# Altium project Camera_Board.PrjPcb
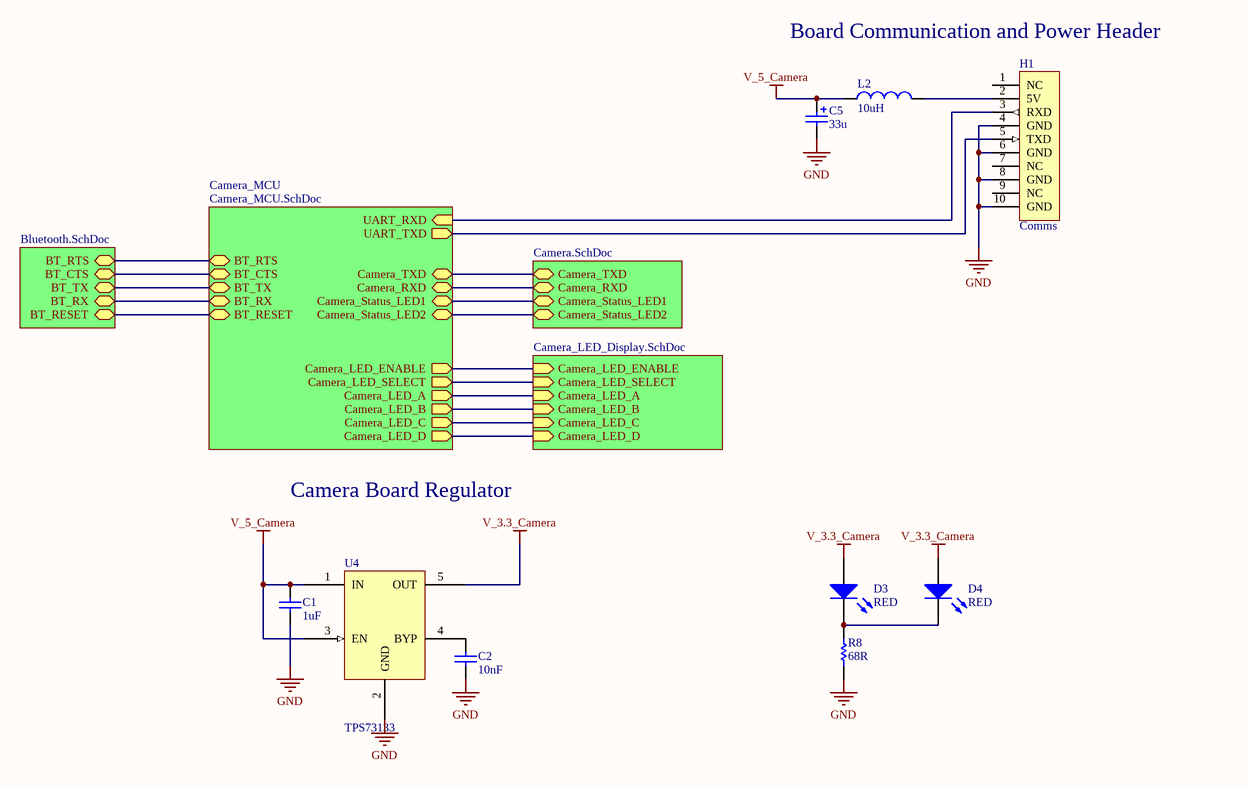
[diagram p0: Camera_Board.SchDoc]
5 sheets, 71 parts. Net scope: hierarchical (ports join the sheet entries above them; power ports are global).
Board file: Camera_Board.PcbDoc
Sheets:
  Camera_Board.SchDoc
     = Bluetooth.SchDoc
     = Camera.SchDoc
    Camera_MCU = Camera_MCU.SchDoc
     = Camera_LED_Display.SchDoc

## Sheet Camera_Board.SchDoc: Camera Board
size A4; DrawnBy: byu17; Organization: ENEL429 Group 9; Address1: ECE Department; Address2: University of Canterbury; Address3: Christchurch 8041; Address4: New Zealand; Revision: 1; SheetNumber: 1; SheetTotal: 4

### Parts
C1  1uF  [0603]
C2  10nF  [0603]
C5  value 33u  [6032]  (hidden comment: CP_TANT_33uF)
D3  value RED  [Diode_0805]  (hidden comment: LED Red)
D4  value RED  [Diode_0805]  (hidden comment: LED Red)
H1  Comms  [918510x323]
L2  10uH  [WE-PD]
R8  68R  [0603]
U4  TPS73133  [DBV005]

### Sub-sheets
Camera_MCU = Camera_MCU.SchDoc: BT_RTS, BT_CTS, BT_RESET, Camera_TXD, Camera_RXD, BT_TX, BT_RX, Camera_Status_LED1, Camera_Status_LED2, UART_TXD (out), UART_RXD (in), Camera_LED_B (out), Camera_LED_C (out), Camera_LED_ENABLE (out), Camera_LED_SELECT (out), Camera_LED_A (out), Camera_LED_D (out)
? = Bluetooth.SchDoc: BT_RX, BT_TX, BT_RTS, BT_CTS, BT_RESET
? = Camera.SchDoc: Camera_RXD, Camera_Status_LED1, Camera_Status_LED2, Camera_TXD
? = Camera_LED_Display.SchDoc: Camera_LED_ENABLE (in), Camera_LED_A (in), Camera_LED_B (in), Camera_LED_C (in), Camera_LED_D (in), Camera_LED_SELECT (in)

### Nets
GND: C1.1 C2.1 C5.2 H1.4(GND) H1.6(GND) H1.8(GND) H1.10(GND) R8.1 U4.2(GND)
V_3.3_Camera: D3.1(A) D4.1(A) U4.5(OUT)
V_5_Camera: C1.2 C5.1 L2.1 U4.1(IN) U4.3(EN)
PA0: sheet Camera_MCU/Camera_LED_A, sheet /Camera_LED_A
PA1: sheet Camera_MCU/Camera_LED_B, sheet /Camera_LED_B
PA2: sheet Camera_MCU/Camera_LED_C, sheet /Camera_LED_C
PA3: sheet Camera_MCU/Camera_LED_D, sheet /Camera_LED_D
PA6: sheet Camera_MCU/Camera_LED_ENABLE, sheet /Camera_LED_ENABLE
PA7: sheet Camera_MCU/Camera_LED_SELECT, sheet /Camera_LED_SELECT
PC2: sheet /BT_TX, sheet Camera_MCU/BT_TX
PC3: sheet /BT_RX, sheet Camera_MCU/BT_RX
PD0: sheet /BT_RTS, sheet Camera_MCU/BT_RTS
PD1: sheet /BT_CTS, sheet Camera_MCU/BT_CTS
PD2: sheet /BT_RESET, sheet Camera_MCU/BT_RESET
PD3: sheet /Camera_Status_LED1, sheet Camera_MCU/Camera_Status_LED1
PD4: sheet /Camera_Status_LED2, sheet Camera_MCU/Camera_Status_LED2
PD6: sheet /Camera_TXD, sheet Camera_MCU/Camera_TXD
PD7: sheet /Camera_RXD, sheet Camera_MCU/Camera_RXD
PE2: H1.3(RXD) ; sheet Camera_MCU/UART_RXD
PE3: H1.5(TXD) ; sheet Camera_MCU/UART_TXD
NetC2_2: C2.2 U4.4(BYP)
NetD3_2: D3.2(K) D4.2(K) R8.2
NetH1_2: H1.2(5V) L2.2

Not connected (* = marked no-connect by the designer): H1 1(NC) 7(NC) 9(NC)

### Notes on the sheet
- Board Communication and Power Header
- Camera Board Regulator
- Title
- Drawn by:
- Date:
- Time:
- Revision:
- Sheet
- of
- File:

### Library data of the parts
C1 = CP_1uF_50V_0603: CAP CER 1.0UF 50V X7R 0603; Manufacturer: Taiyo Yuden; Manufacturer PN: UMK107C5105KA-T; Supplier Part Number 1: 445-5090-2-ND; Supplier 1: Digi-Key; Value: 1uF; Part Number: CP_1uF_50V_0603; Component Kind: Standard; Component Type: Standard; Designator: CP_1uF_50V_0603; Pin Count: 2; Signal Integrity: Cap; Simulation: CAP
C2 = CP_10nF 0603: CAP CER 10000PF 100V X7R 0603; Manufacturer: Taiyo Yuden; Manufacturer PN: HMK107B7103KA-T; Supplier 1: Digi-Key; Supplier Part Number 1: 587-1446-2-ND; Value: 10nF; Part Number: CP_10nF 0603; Component Kind: Standard; Component Type: Standard; Designator: CP_10nF 0603; Pin Count: 2; Signal Integrity: Cap; Simulation: CAP
C5 = CP_TANT_33UF_20V: CAP TANT 33UF 20V 10% SMD; Manufacturer: Vishay; Manufacturer PN: TR3C336K020C0200; Signal Integrity: Cap Pol; Latest Revision Date: 20 Feb 09; Supplier 1: Digi-Key; Supplier Part Number 1: 718-1507-2-ND; Part Number: CP_TANT_33UF_20V; Component Kind: Standard; Component Type: Standard; Designator: CP_TANT_33UF_20V; Pin Count: 2; Simulation: CAP
D3 D4 = DL_LED Red 0805: Red LED 0805; Manufacturer PN: TLMS2100-GS08; Manufacturer: Vishay; Supplier 1: Digi-Key; Supplier Part Number 1: 350-2038-1-ND; Part Number: DL_LED Red 0805; Component Kind: Standard; Component Type: Standard; Designator: DL_LED Red 0805; Pin Count: 2; Simulation: LED0
H1 = Header 10: Header, IDC 10-Pin; LatestRevisionDate: 17-Jul-2002; LatestRevisionNote: Re-released for DXP Platform.; Publisher: Altium Limited
L2 = IN_10uH 2A SMT: INDUCTOR POWER 10UH 2.0A SMD; Manufacturer: Wurth Electronics Inc; Manufacturer PN: 744777910; LatestRevisionDate: 29 May 08; Supplier 1: Digi-Key; Supplier Part Number 1: 732-1191-1-ND; Value: 10uH; Part Number: IN_10uH 2A SMT; Component Kind: Standard; Component Type: Standard; Designator: IN_10uH 2A SMT; Pin Count: 2; Signal Integrity: Inductor; Simulation: INDUCTOR
R8 = RS_68R 0603: RES 68 OHM 1/10W 1% 0603 SMD; Manufacturer: Yageo; Manufacturer PN: RC0603FR-0768KL; LatestRevisionDate: 6 May 2011; Supplier 1: Digi-Key; Supplier Part Number 1: 311-68.0HRTR-ND; Value: 68R; Part Number: RS_68R 0603; Component Kind: Standard; Component Type: Standard; Designator: RS_68R 0603; Pin Count: 2; Signal Integrity: Res; Simulation: RESISTOR
U4 = IC_TPS73133: 150mA 3.3V linear regulator with 30mV dropout; Manufacturer: Texas Instruments; Supplier 1: Element 14; Supplier Part Number 1: 1207341; price: 0.84; Supplier 2: Digi-Key; Supplier Part Number 2: 296-15805-1-ND; value: TPS73133; Part Number: IC_TPS73133; Component Kind: Standard; Component Type: Standard; Designator: IC_TPS73133; Pin Count: 5

## Sheet Bluetooth.SchDoc: Bluetooth
size A4; DrawnBy: zjt14; Organization: ENEL429 Group 9; Address1: ECE Department; Address2: University of Canterbury; Address3: Christchurch 8041; Address4: New Zealand; Revision: 1; SheetNumber: 3; SheetTotal: 4
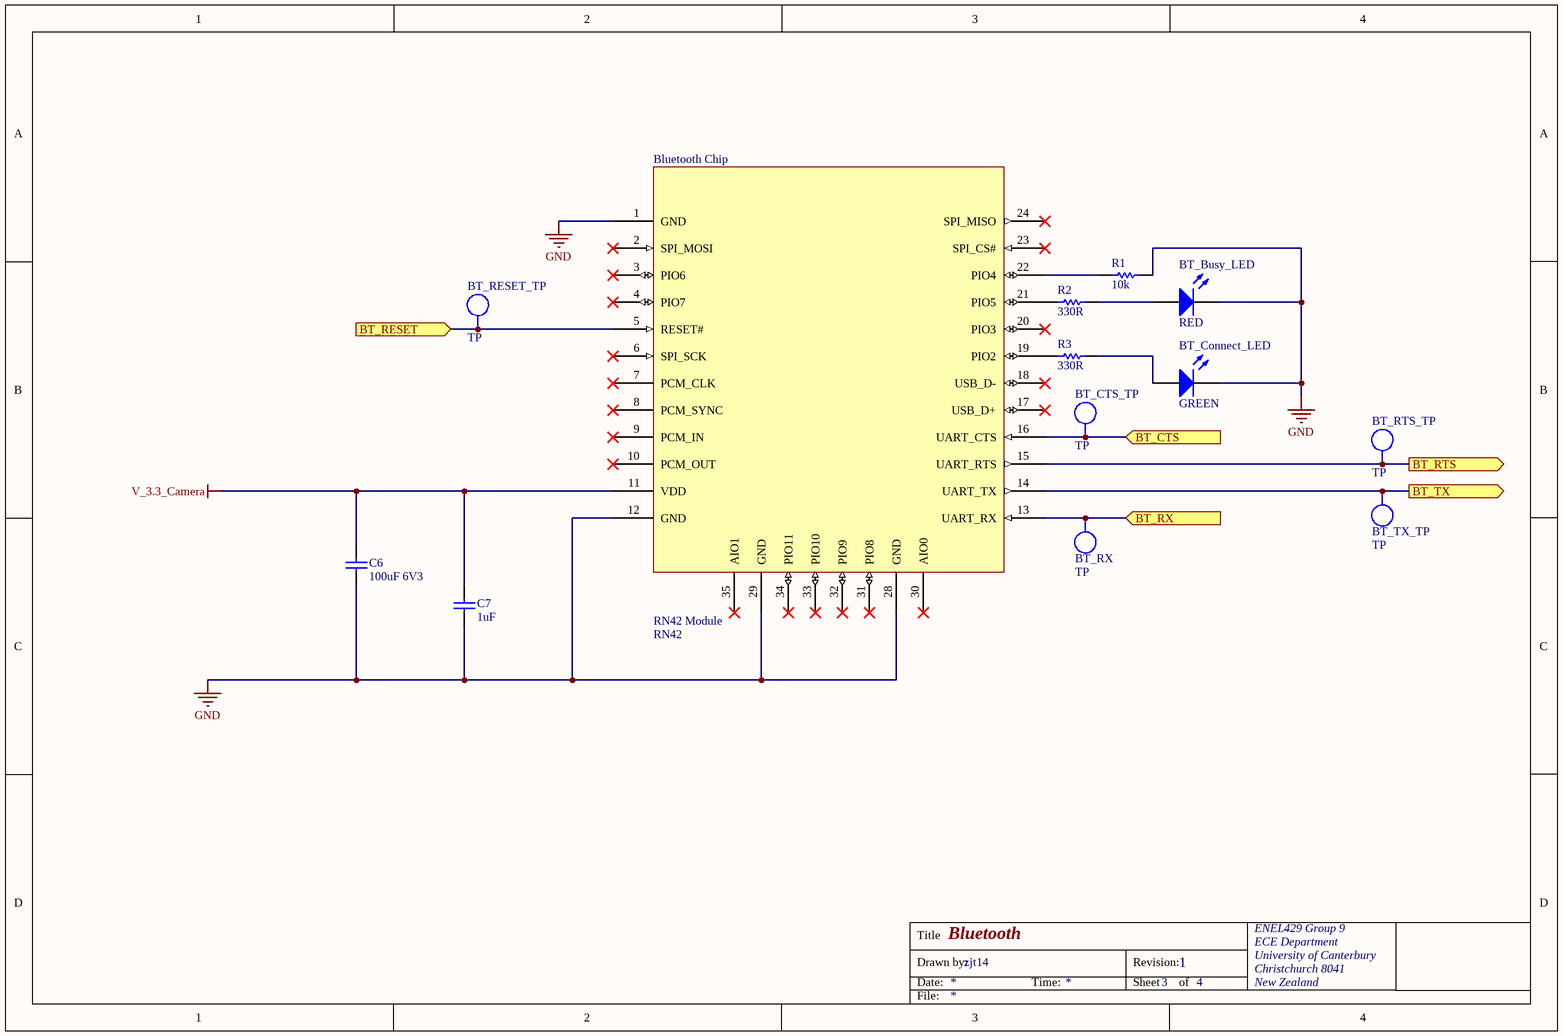
[diagram p1: Bluetooth.SchDoc]

### Parts
Bluetooth_Chip  RN42 Module  value RN42  [RN42-LAND]  (no BOM)
BT_Busy_LED  value RED  [Diode_0805]  (hidden comment: LED Red)
BT_Connect_LED  value GREEN  [DIODE_0805]  (hidden comment: LED Green)
BT_CTS_TP  TP  [TEST_POINT_4X2MM]  (no BOM)
BT_RESET_TP  TP  [TEST_POINT_4X2MM]  (no BOM)
BT_RTS_TP  TP  [TEST_POINT_4X2MM]  (no BOM)
BT_RX  TP  [TEST_POINT_4X2MM]  (no BOM)
BT_TX_TP  TP  [TEST_POINT_4X2MM]  (no BOM)
C6  100uF 6V3  [1206]
C7  1uF  [0603]
R1  10k  [0603]
R2  330R  [0603]
R3  330R  [0603]

### Ports
BT_CTS (in), BT_RESET (in), BT_RTS (out), BT_RX (in), BT_TX (out)

### Nets
GND: Bluetooth_Chip.1(GND) Bluetooth_Chip.12(GND) Bluetooth_Chip.28(GND) Bluetooth_Chip.29(GND) BT_Busy_LED.2(K) BT_Connect_LED.2(K) C6.2 C7.2 R1.2
V_3.3_Camera: Bluetooth_Chip.11(VDD) C6.1 C7.1
PC2: Bluetooth_Chip.14(UART_TX) BT_TX_TP.1 ; port BT_TX
PC3: Bluetooth_Chip.13(UART_RX) BT_RX.1 ; port BT_RX
PD0: Bluetooth_Chip.15(UART_RTS) BT_RTS_TP.1 ; port BT_RTS
PD1: Bluetooth_Chip.16(UART_CTS) BT_CTS_TP.1 ; port BT_CTS
PD2: Bluetooth_Chip.5(RESET#) BT_RESET_TP.1 ; port BT_RESET
NetBluetooth_Chip_19: Bluetooth_Chip.19(PIO2) R3.1
NetBluetooth_Chip_21: Bluetooth_Chip.21(PIO5) R2.1
NetBluetooth_Chip_22: Bluetooth_Chip.22(PIO4) R1.1
NetBT_Busy_LED_1: BT_Busy_LED.1(A) R2.2
NetBT_Connect_LED_1: BT_Connect_LED.1(A) R3.2

Not connected (* = marked no-connect by the designer): Bluetooth_Chip 2(SPI_MOSI)* 3(PIO6)* 4(PIO7)* 6(SPI_SCK)* 7(PCM_CLK)* 8(PCM_SYNC)* 9(PCM_IN)* 10(PCM_OUT)* 17(USB_D+)* 18(USB_D-)* 20(PIO3)* 23(SPI_CS#)* 24(SPI_MISO)* 30(AIO0)* 31(PIO8)* 32(PIO9)* 33(PIO10)* 34(PIO11)* 35(AIO1)*

### Notes on the sheet
- Title
- Drawn by:
- Date:
- Time:
- Revision:
- Sheet
- of
- File:

### Library data of the parts
Bluetooth_Chip = RN42MOD: Manufacturer: Roving Networks; Manufacturer PN: RN-42; Supplier 1: Sparkfun; Supplier Part Number 1: WRL-10253
BT_Busy_LED = DL_LED Red 0805: as D3 on sheet Camera_Board; Part Number: DL_LED Red 0805; Component Kind: Standard; Component Type: Standard; Designator: DL_LED Red 0805; Pin Count: 2; Supplier 1: Digi-Key; Supplier Part Number 1: 350-2038-1-ND; Simulation: LED0
BT_Connect_LED = DL_LED Green 0805: Green LED 0805; Manufacturer: Vishay; Verify: Not checked; Part Number: DL_LED Green 0805; Component Kind: Standard; Component Type: Standard; Designator: DL_LED Green 0805; Footprint: LED_RA_SMD; Pin Count: 2; Supplier 1: Digi-Key; Supplier Part Number 1: 160-1179-2-ND; Simulation: LED0
BT_CTS_TP BT_RESET_TP BT_RTS_TP BT_RX BT_TX_TP = TP_TESTPOINT: Test-Point; LatestRevisionDate: 29 May 08; Manufacturer PN: *; Manufacturer: *; Supplier 1: Digi-Key; Supplier Part Number 1: 5016KTR-ND; Value: TP; Part Number: TP_TESTPOINT; Component Type: Standard (No BOM); Designator: TP_TESTPOINT; Pin Count: 1
C6 = CP_CER 100uF_1206_6V3: 100uF 6.3V 1206 multi-layer ceramic capacitor; Manufacturer PN: C1206C107M9PACTU; Manufacturer: Kemet; price: 2.56; value: 100uF 6V3; Part Number: CP_CER 100uF_1206_6V3; Component Kind: Standard; Component Type: Standard; Designator: CP_CER 100uF_1206_6V3; Pin Count: 2; Supplier Part Number 1: 399-5620-1-ND; Supplier 1: Digi-Key
C7 = CP_1uF_50V_0603: as C1 on sheet Camera_Board; Value: 1uF; Part Number: CP_1uF_50V_0603; Component Kind: Standard; Component Type: Standard; Designator: CP_1uF_50V_0603; Pin Count: 2; Supplier Part Number 1: 445-5090-2-ND; Supplier 1: Digi-Key; Signal Integrity: Cap; Simulation: CAP
R1 = RS_10k 0603: RES 10.0K OHM 1/10W 1% 0603 SMD; Manufacturer: Yageo; Manufacturer PN: RC0603FR-0710KL; Value: 10k; Part Number: RS_10k 0603; Component Kind: Standard; Component Type: Standard; Designator: RS_10k 0603; Pin Count: 2; LatestRevisionDate: 29 May 08; Supplier 1: Digi-Key; Supplier Part Number 1: 311-10.0KHRTR-ND; Signal Integrity: Res; Simulation: RESISTOR
R2 R3 = RS_330R 0603: RES 330 OHM 1/10W 1% 0603 SMD; Manufacturer: Yageo; Manufacturer PN: RC0603FR-07330RL; Value: 330R; Part Number: RS_330R 0603; Component Kind: Standard; Component Type: Standard; Designator: RS_330R 0603; Pin Count: 2; LatestRevisionDate: 25 June 2009; Supplier 1: Digi-Key; Supplier Part Number 1: 311-330HRTR-ND; Signal Integrity: Res; Simulation: RESISTOR

## Sheet Camera.SchDoc: Camera Module
size A4; DrawnBy: byu17; Organization: ENEL429 Group 9; Address1: ECE Department; Address2: University of Canterbury; Address3: Christchurch 8041; Address4: New Zealand; Revision: 1; SheetNumber: 2; SheetTotal: 4
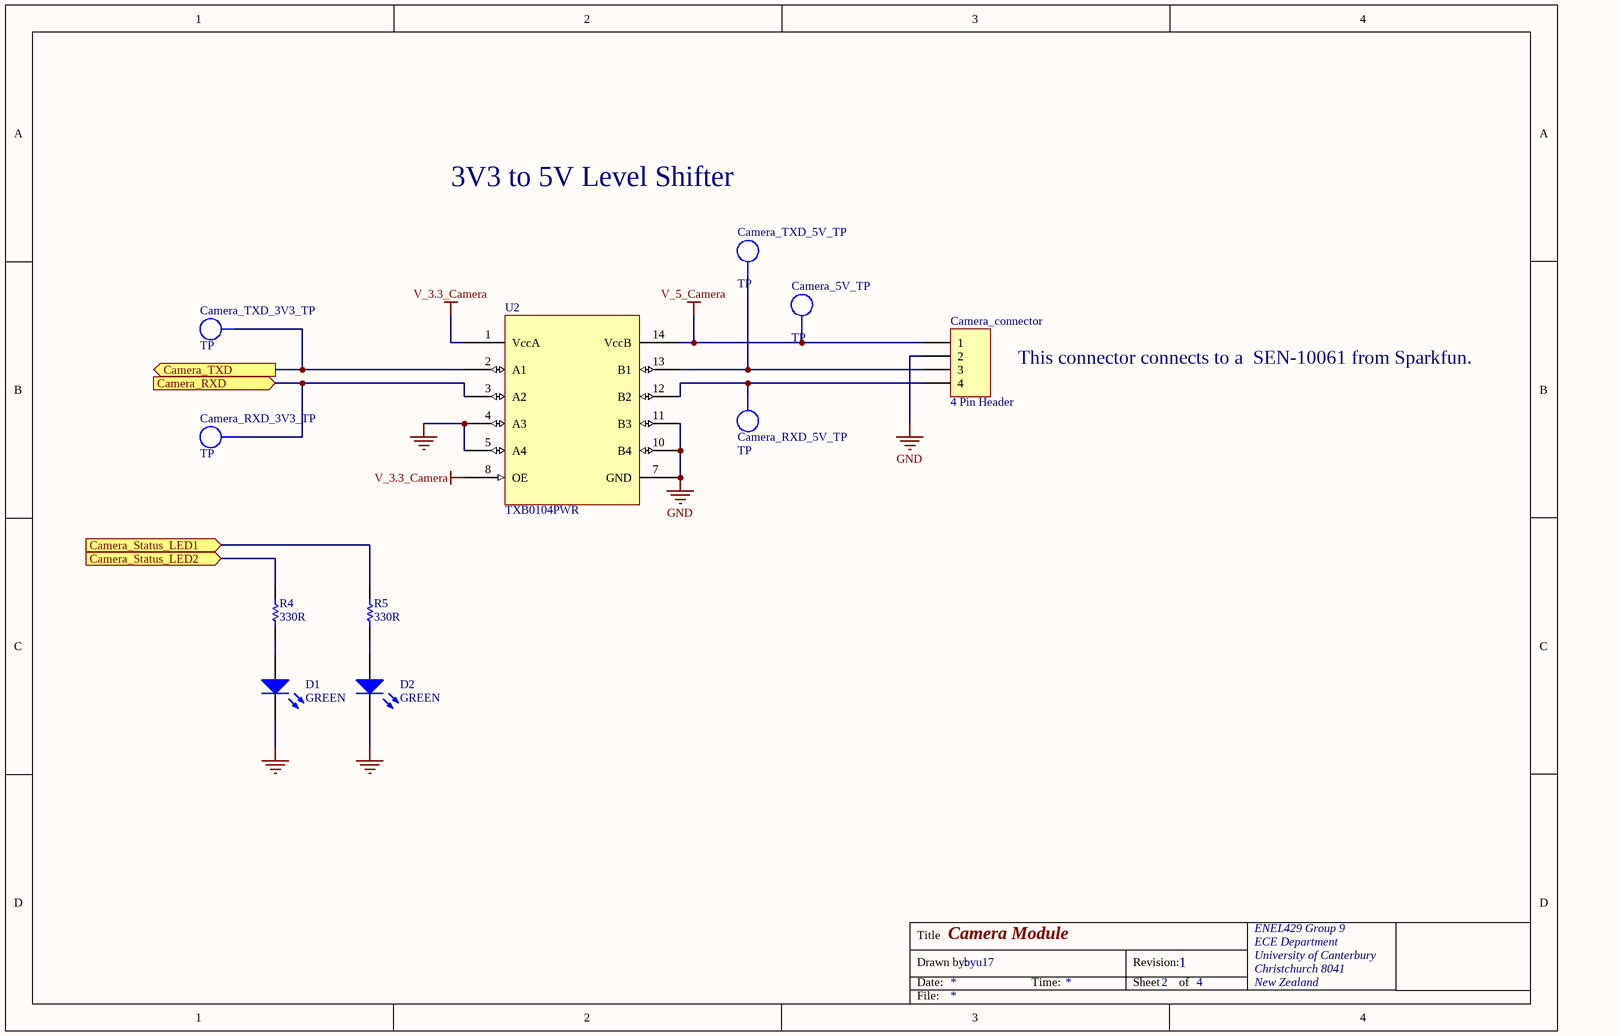
[diagram p2: Camera.SchDoc]

### Parts
Camera_5V_TP  TP  [TEST_POINT_4X2MM]  (no BOM)
Camera_connector  4 Pin Header  [CONN_4X1_SMT_RA_1.25MM]
Camera_RXD_3V3_TP  TP  [TEST_POINT_4X2MM]  (no BOM)
Camera_RXD_5V_TP  TP  [TEST_POINT_4X2MM]  (no BOM)
Camera_TXD_3V3_TP  TP  [TEST_POINT_4X2MM]  (no BOM)
Camera_TXD_5V_TP  TP  [TEST_POINT_4X2MM]  (no BOM)
D1  value GREEN  [DIODE_0805]  (hidden comment: LED Green)
D2  value GREEN  [DIODE_0805]  (hidden comment: LED Green)
R4  330R  [0603]
R5  330R  [0603]
U2  value TXB0104PWR  [TSSOP-14_PW]  (hidden comment: IC_TXB0104PWR)

### Ports
Camera_RXD (in), Camera_Status_LED1 (in), Camera_Status_LED2 (in), Camera_TXD (out)

### Nets
GND: Camera_connector.2 D1.2(K) D2.2(K) U2.4(A3) U2.5(A4) U2.7(GND) U2.10(B4) U2.11(B3)
V_3.3_Camera: U2.1(VccA) U2.8(OE)
V_5_Camera: Camera_5V_TP.1 Camera_connector.1 U2.14(VccB)
PD3: R5.1 ; port Camera_Status_LED1
PD4: R4.1 ; port Camera_Status_LED2
PD6: Camera_TXD_3V3_TP.1 U2.2(A1) ; port Camera_TXD
PD7: Camera_RXD_3V3_TP.1 U2.3(A2) ; port Camera_RXD
NetCamera_connector_3: Camera_connector.3 Camera_TXD_5V_TP.1 U2.13(B1)
NetCamera_connector_4: Camera_connector.4 Camera_RXD_5V_TP.1 U2.12(B2)
NetD1_1: D1.1(A) R4.2
NetD2_1: D2.1(A) R5.2

### Notes on the sheet
- 3V3 to 5V Level Shifter
- This connector connects to a  SEN-10061 from Sparkfun.
- Title
- Drawn by:
- Date:
- Time:
- Revision:
- Sheet
- of
- File:

### Library data of the parts
Camera_5V_TP Camera_RXD_3V3_TP Camera_RXD_5V_TP Camera_TXD_3V3_TP Camera_TXD_5V_TP = TP_TESTPOINT: Test-Point; LatestRevisionDate: 29 May 08; Manufacturer PN: *; Manufacturer: *; Supplier 1: Digi-Key; Supplier Part Number 1: 5016KTR-ND; Value: TP; Part Number: TP_TESTPOINT; Component Type: Standard (No BOM); Designator: TP_TESTPOINT; Pin Count: 1
Camera_connector = JP_4PIN HDR_SMT_RA_MOLEX_1: CONN HDR VERT 4POS .100" SNGL; Manufacturer: Molex; Manufacturer PN: 53261-0471; Verify: Not Checked; LatestRevisionDate: 24 Jun 08; Supplier 1: Digi-Key; Supplier Part Number 1: WM7622CT-ND; Value: 4 Pin Header; Part Number: JP_4PIN HDR_SMT_RA_MOLEX_1; Component Kind: Standard; Component Type: Standard; Designator: JP_4PIN HDR_SMT_RA_MOLEX_1; Pin Count: 4
D1 D2 = DL_LED Green 0805: as BT_Connect_LED on sheet Bluetooth; Part Number: DL_LED Green 0805; Component Kind: Standard; Component Type: Standard; Designator: DL_LED Green 0805; Footprint: LED_RA_SMD; Pin Count: 2; Supplier 1: Digi-Key; Supplier Part Number 1: 160-1179-2-ND; Simulation: LED0
R4 R5 = RS_330R 0603: as R2 on sheet Bluetooth; Value: 330R; Part Number: RS_330R 0603; Component Kind: Standard; Component Type: Standard; Designator: RS_330R 0603; Pin Count: 2; LatestRevisionDate: 25 June 2009; Supplier 1: Digi-Key; Supplier Part Number 1: 311-330HRTR-ND; Signal Integrity: Res; Simulation: RESISTOR
U2 = IC_TXB0104PWR: IC VOLT-LEVEL TRANSLATOR 14TSSOP; Manufacturer: Texas Instruments; Verify: Not Checked; Manufacturer PN: TXB0104PWR; Supplier 1: Digi-Key; Supplier Part Number 1: 296-21929-1-ND; Part Number: IC_TXB0104PWR; Component Kind: Standard; Component Type: Standard; Designator: IC_TXB0104PWR; Pin Count: 12

## Sheet Camera_MCU.SchDoc: Camera Board MCU
size A4; DrawnBy: byu17; Organization: ENEL429 Group 9; Address1: ECE Department; Address2: University of Canterbury; Address3: Christchurch 8041; Address4: New Zealand; Revision: 1
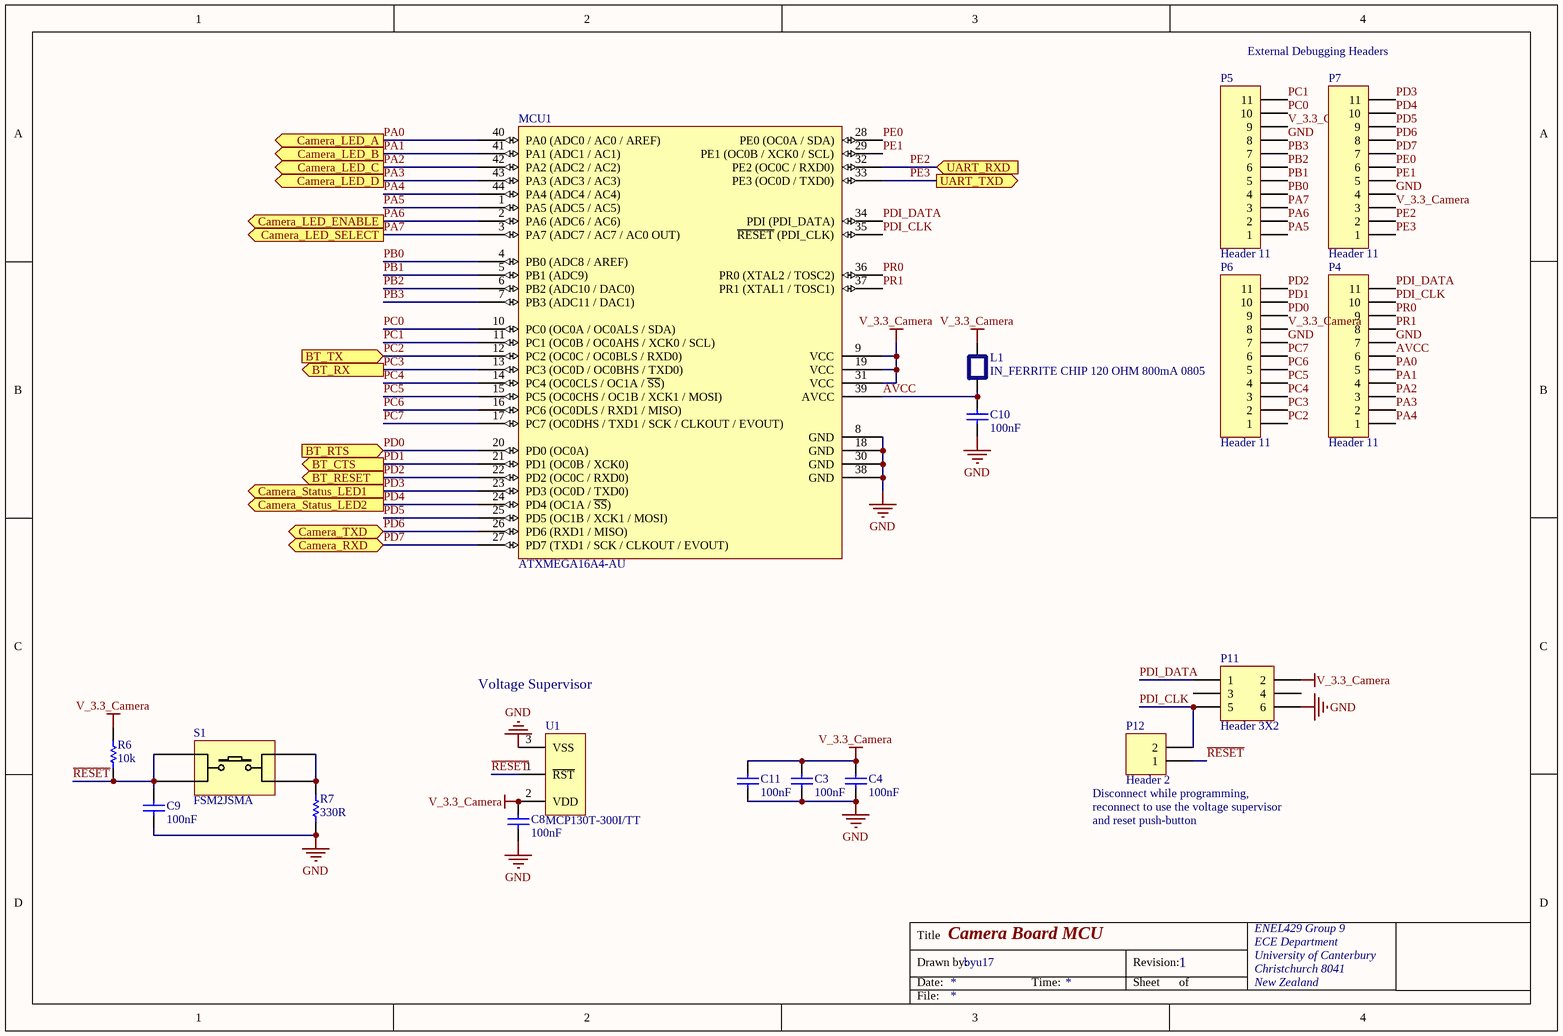
[diagram p3: Camera_MCU.SchDoc]

### Parts
C3  100nF  [0603]
C4  100nF  [0603]
C8  100nF  [0603]
C9  100nF  [0603]
C10  100nF  [0603]
C11  100nF  [0603]
L1  IN_FERRITE CHIP 120 OHM 800mA 0805  [0805]
MCU1  ATXMEGA16A4-AU  [TQFP80P1200X1200X120-44N]
P4  Header 11  [HDR1X11]
P5  Header 11  [HDR1X11]
P6  Header 11  [HDR1X11]
P7  Header 11  [HDR1X11]
P11  Header 3X2  [HDR2X3]
P12  Header 2  [HDR1X2]
R6  10k  [0603]
R7  330R  [0603]
S1  FSM2JSMA  [FSM2JSMA]
U1  MCP130T-300I/TT  [SOT-23-TT3_N]

### Ports
BT_CTS (out), BT_RESET (out), BT_RTS (in), BT_RX (out), BT_TX (in), Camera_LED_A (out), Camera_LED_B (out), Camera_LED_C (out), Camera_LED_D (out), Camera_LED_ENABLE (out), Camera_LED_SELECT (out), Camera_RXD, Camera_Status_LED1 (out), Camera_Status_LED2 (out), Camera_TXD, UART_RXD (in), UART_TXD (out)

### Nets
GND: C3.1 C4.1 C8.2 C9.2 C10.1 C11.2 MCU1.8(GND) MCU1.18(GND) MCU1.30(GND) MCU1.38(GND) P4.7 P5.8 P6.7 P7.4 P11.6 R7.1 U1.3(VSS)
V_3.3_Camera: C3.2 C4.2 C8.1 C11.1 L1.1 MCU1.9(VCC) MCU1.19(VCC) MCU1.31(VCC) P5.9 P6.8 P7.3 P11.2 R6.2 U1.2(VDD)
AVCC: C10.2 L1.2 MCU1.39(AVCC) P4.6
PA0: MCU1.40(PA0_(ADC0_/_AC0_/_AREF)) P4.5 ; port Camera_LED_A
PA1: MCU1.41(PA1_(ADC1_/_AC1)) P4.4 ; port Camera_LED_B
PA2: MCU1.42(PA2_(ADC2_/_AC2)) P4.3 ; port Camera_LED_C
PA3: MCU1.43(PA3_(ADC3_/_AC3)) P4.2 ; port Camera_LED_D
PA4: MCU1.44(PA4_(ADC4_/_AC4)) P4.1
PA5: MCU1.1(PA5_(ADC5_/_AC5)) P5.1
PA6: MCU1.2(PA6_(ADC6_/_AC6)) P5.2 ; port Camera_LED_ENABLE
PA7: MCU1.3(PA7_(ADC7_/_AC7_/_AC0_OUT)) P5.3 ; port Camera_LED_SELECT
PB0: MCU1.4(PB0_(ADC8_/_AREF)) P5.4
PB1: MCU1.5(PB1_(ADC9)) P5.5
PB2: MCU1.6(PB2_(ADC10_/_DAC0)) P5.6
PB3: MCU1.7(PB3_(ADC11_/_DAC1)) P5.7
PC0: MCU1.10(PC0_(OC0A_/_OC0ALS_/_SDA)) P5.10
PC1: MCU1.11(PC1_(OC0B_/_OC0AHS_/_XCK0_/_SCL)) P5.11
PC2: MCU1.12(PC2_(OC0C_/_OC0BLS_/_RXD0)) P6.1 ; port BT_TX
PC3: MCU1.13(PC3_(OC0D_/_OC0BHS_/_TXD0)) P6.2 ; port BT_RX
PC4: MCU1.14(PC4_(OC0CLS_/_OC1A_/_~{SS})) P6.3
PC5: MCU1.15(PC5_(OC0CHS_/_OC1B_/_XCK1_/_MOSI)) P6.4
PC6: MCU1.16(PC6_(OC0DLS_/_RXD1_/_MISO)) P6.5
PC7: MCU1.17(PC7_(OC0DHS_/_TXD1_/_SCK_/_CLKOUT_/_EVOUT)) P6.6
PD0: MCU1.20(PD0_(OC0A)) P6.9 ; port BT_RTS
PD1: MCU1.21(PD1_(OC0B_/_XCK0)) P6.10 ; port BT_CTS
PD2: MCU1.22(PD2_(OC0C_/_RXD0)) P6.11 ; port BT_RESET
PD3: MCU1.23(PD3_(OC0D_/_TXD0)) P7.11 ; port Camera_Status_LED1
PD4: MCU1.24(PD4_(OC1A_/_~{SS})) P7.10 ; port Camera_Status_LED2
PD5: MCU1.25(PD5_(OC1B_/_XCK1_/_MOSI)) P7.9
PD6: MCU1.26(PD6_(RXD1_/_MISO)) P7.8 ; port Camera_TXD
PD7: MCU1.27(PD7_(TXD1_/_SCK_/_CLKOUT_/_EVOUT)) P7.7 ; port Camera_RXD
PDI_CLK: MCU1.35(~{RESET}_(PDI_CLK)) P4.10 P11.5 P12.2
PDI_DATA: MCU1.34(PDI_(PDI_DATA)) P4.11 P11.1
PE0: MCU1.28(PE0_(OC0A_/_SDA)) P7.6
PE1: MCU1.29(PE1_(OC0B_/_XCK0_/_SCL)) P7.5
PE2: MCU1.32(PE2_(OC0C_/_RXD0)) P7.2 ; port UART_RXD
PE3: MCU1.33(PE3_(OC0D_/_TXD0)) P7.1 ; port UART_TXD
PR0: MCU1.36(PR0_(XTAL2_/_TOSC2)) P4.9
PR1: MCU1.37(PR1_(XTAL1_/_TOSC1)) P4.8
~{RESET}: C9.1 P12.1 R6.1 S1.1 S1.2 U1.1(~{RST})
NetR7_2: R7.2 S1.3 S1.4

Not connected (* = marked no-connect by the designer): P11 3 4

### Notes on the sheet
- External Debugging Headers
- Voltage Supervisor
- (near P12) Disconnect while programming,
- (near P12) reconnect to use the voltage supervisor
- and reset push-button
- Title
- Drawn by:
- Date:
- Time:
- Revision:
- Sheet
- of
- File:

### Library data of the parts
C3 C4 C8-C11 = CP_100nF 0603: CAP CER .10UF 50V X5R 0603; Manufacturer: Taiyo Yuden; Manufacturer PN: UMK107B7104KA-T; Value: 100nF; Part Number: CP_100nF 0603; Component Kind: Standard; Component Type: Standard; Designator: CP_100nF 0603; Pin Count: 2; LatestRevisionDate: 29 May 08; Supplier 1: Digi-Key; Supplier Part Number 1: 478-6206-1-ND; Signal Integrity: Cap; Simulation: CAP
L1 = IN_FERRITE CHIP 120 OHM 800mA 0805: FERRITE CHIP 120 OHM 800mA 0805; Manufacturer: TDK; Manufacturer PN: MMZ2012Y121B; Part Number: IN_FERRITE CHIP 120 OHM 800mA 0805; Component Kind: Standard; Component Type: Standard; Designator: IN_FERRITE CHIP 120 OHM 800mA 0805; Pin Count: 2; Supplier 1: Digi-Key; Supplier Part Number 1: 445-2196-2-ND
MCU1 = ATXMEGA16A4-AU: Manufacturer: ATMEL; Manufacturer PN: ATXMEGA16A4-AU; Supplier 1: Element 14; Supplier Part Number 1: 1748552
P4-P7 = Header 11: Header, 11-Pin; LatestRevisionDate: 17-Jul-2002; LatestRevisionNote: Re-released for DXP Platform.; Publisher: Altium Limited
P11 = Header 3X2: Header, 3-Pin, Dual row; LatestRevisionDate: 17-Jul-2002; LatestRevisionNote: Re-released for DXP Platform.; Publisher: Altium Limited
P12 = Header 2: Header, 2-Pin; LatestRevisionDate: 17-Jul-2002; LatestRevisionNote: Re-released for DXP Platform.; Publisher: Altium Limited
R6 = RS_10k 0603: as R1 on sheet Bluetooth; Value: 10k; Part Number: RS_10k 0603; Component Kind: Standard; Component Type: Standard; Designator: RS_10k 0603; Pin Count: 2; LatestRevisionDate: 29 May 08; Supplier 1: Digi-Key; Supplier Part Number 1: 311-10.0KHRTR-ND; Signal Integrity: Res; Simulation: RESISTOR
R7 = RS_330R 0603: as R2 on sheet Bluetooth; Value: 330R; Part Number: RS_330R 0603; Component Kind: Standard; Component Type: Standard; Designator: RS_330R 0603; Pin Count: 2; LatestRevisionDate: 25 June 2009; Supplier 1: Digi-Key; Supplier Part Number 1: 311-330HRTR-ND; Signal Integrity: Res; Simulation: RESISTOR
S1 = SW_FSM2JSMA: DPST SMD Switch; Manufacturer: Tyco Electronics; Supplier 1: Element 14; Supplier Part Number 1: 3801287; price: 0.516; Supplier 2: Digi-Key; Supplier Part Number 2: 450-1130-ND; value: FSM2JSMA; Part Number: SW_FSM2JSMA; Component Kind: Standard; Component Type: Standard; Designator: SW_FSM2JSMA; Pin Count: 4
U1 = MCP130T-300I/TT: Microcontroller Supervisory Circuit with Open Drain Output, 3-Pin SOT-23, Industrial Temperature, Tape and Reel; FirstPublished: 29-Jan-2009; DatasheetVersion: revD, 2001; PackageVersion: revBB, Aug-2009; PackageReference: SOT-23-TT3; Publisher: Altium Limited; PackageDescription: 3-Lead Plastic Small Outline Transistor (TT) [SOT-23]; Supplier 1: Digi-Key; Supplier Part Number 1: MCP130T-300I/TTTR-ND; Supplier 2: Digi-Key; Supplier Part Number 2: MCP130T-300I/TTCT-ND; Supplier 3: Digi-Key; Supplier Part Number 3: MCP130T-300I/TTDKR-ND; Supplier 4: Farnell; Supplier Part Number 4: 1332070; Supplier 5: Newark; Supplier Part Number 5: 19C7176; Code_IPC: SOT23-3; ComponentLink1Description: Datasheet; ComponentLink1URL: http://ww1.microchip.com/downloads/en/DeviceDoc/11184d.pdf; ComponentLink2Description: Packaging Specification; ComponentLink2URL: http://www.microchip.com/stellent/groups/techpub_sg/documents/packagingspec/en012702.pdf; ComponentLink3Description: Microchip.com Home; ComponentLink3URL: http://www.microchip.com/

## Sheet Camera_LED_Display.SchDoc
size A4; Organization: ENEL429 Group N; Address1: ECE Department; Address2: University of Canterbury; Address3: Christchurch 8041; Address4: New Zealand; Revision: 1
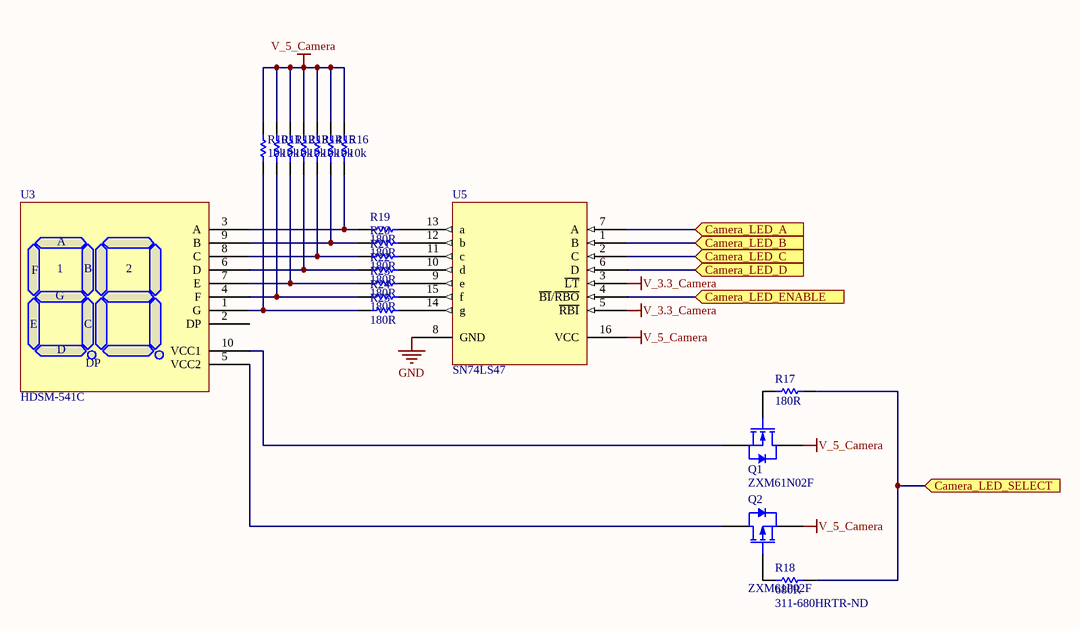
[diagram p4: Camera_LED_Display.SchDoc]

### Parts
Q1  ZXM61N02F  [SOT-23]
Q2  ZXM61P02F  [SOT23]
R10  10k  [0603]
R11  10k  [0603]
R12  10k  [0603]
R13  10k  [0603]
R14  10k  [0603]
R15  10k  [0603]
R16  10k  [0603]
R17  180R  [0603]
R18  Supplier Part Number 1: 311-680HRTR-ND  [0603]  (hidden comment: 680R)
R19  180R  [0603]
R20  180R  [0603]
R21  180R  [0603]
R22  180R  [0603]
R23  180R  [0603]
R24  180R  [0603]
R25  180R  [0603]
U3  HDSM-541C  [HDSM-541C]
U5  SN74LS47  [SOP127P780X200-16N]

### Ports
Camera_LED_A (in), Camera_LED_B (in), Camera_LED_C (in), Camera_LED_D (in), Camera_LED_ENABLE (in), Camera_LED_SELECT (in)

### Nets
GND: U5.8(GND)
V_3.3_Camera: U5.3(~{LT}) U5.5(~{RBI})
V_5_Camera: Q1.3(D) Q2.2(S) R10.2 R11.2 R12.2 R13.2 R14.2 R15.2 R16.2 U5.16(VCC)
PA0: U5.7(A) ; port Camera_LED_A
PA1: U5.1(B) ; port Camera_LED_B
PA2: U5.2(C) ; port Camera_LED_C
PA3: U5.6(D) ; port Camera_LED_D
PA6: U5.4(~{BI}/~{RBO}) ; port Camera_LED_ENABLE
PA7: R17.2 R18.2 ; port Camera_LED_SELECT
NetQ1_1: Q1.1(G) R17.1
NetQ1_2: Q1.2(S) U3.10(VCC1)
NetQ2_1: Q2.1(G) R18.1
NetQ2_3: Q2.3(D) U3.5(VCC2)
NetR10_1: R10.1 R25.1 U3.1(G)
NetR11_1: R11.1 R24.1 U3.4(F)
NetR12_1: R12.1 R23.1 U3.7(E)
NetR13_1: R13.1 R22.1 U3.6(D)
NetR14_1: R14.1 R21.1 U3.8(C)
NetR15_1: R15.1 R20.1 U3.9(B)
NetR16_1: R16.1 R19.1 U3.3(A)
NetR19_2: R19.2 U5.13(a)
NetR20_2: R20.2 U5.12(b)
NetR21_2: R21.2 U5.11(c)
NetR22_2: R22.2 U5.10(d)
NetR23_2: R23.2 U5.9(e)
NetR24_2: R24.2 U5.15(f)
NetR25_2: R25.2 U5.14(g)

Not connected (* = marked no-connect by the designer): U3 2(DP)

### Notes on the sheet
- Title
- Drawn by:
- Date:
- Time:
- Revision:
- Sheet
- of
- File:

### Library data of the parts
Q1 = TF_ZXM61N02F: 20V N-channel enhancement mode MOSFET; Manufacturer: Zetex; Supplier 1: Element 14; Supplier Part Number 1: 9525270; price: 1.28; Supplier 2: Digi-Key; Supplier Part Number 2: ZXM61N02FCT-ND; value: ZXM61N02F; Part Number: TF_ZXM61N02F; Component Kind: Standard; Component Type: Standard; Designator: TF_ZXM61N02F; Pin Count: 3; PCB3D: sot23
Q2 = TF_ZXM61P02F: 20V P-channel enhancement mode MOSFET; Manufacturer: Zetex; Supplier 1: Element 14; Supplier Part Number 1: 9525297; price: 1.31; Supplier 2: Digi-Key; Supplier Part Number 2: ZXM61P02FCT-ND; value: ZXM61P02F; Part Number: TF_ZXM61P02F; Component Kind: Standard; Component Type: Standard; Designator: TF_ZXM61P02F; Pin Count: 3; PCB3D: sot23
R10-R16 = RS_10k 0603: as R1 on sheet Bluetooth; LatestRevisionDate: 29 May 08; Supplier 1: Digi-Key; Supplier Part Number 1: 311-10.0KHRTR-ND; Value: 10k; Part Number: RS_10k 0603; Component Kind: Standard; Component Type: Standard; Designator: RS_10k 0603; Pin Count: 2; Signal Integrity: Res; Simulation: RESISTOR
R17 R19-R25 = RS_180R 0603: RES 180OHM 1/10W 1% 0603 SMD; Manufacturer: Panasonic - ECG; Manufacturer PN: ERJ-3EKF1800V; LatestRevisionDate: 25 June 2009; Supplier 1: Digi-Key; Supplier Part Number 1: P180HTR-ND; Value: 180R; Part Number: RS_180R 0603; Component Kind: Standard; Component Type: Standard; Designator: RS_180R 0603; Pin Count: 2; Signal Integrity: Res; Simulation: RESISTOR
R18 = RS_680R 0603: RES 680 OHM 1/10W 1% 0603 SMD; Manufacturer: Yageo; Manufacturer PN: RC0603FR-07680RL; LatestRevisionDate: 29 May 08; Supplier 1: Digi-Key; Value: 680R; Part Number: RS_680R 0603; Component Kind: Standard; Component Type: Standard; Designator: RS_680R 0603; Pin Count: 2; Signal Integrity: Res; Simulation: RESISTOR
U3 = HDSM-541C: 2 character 7 segment display; Manufacturer: AVAGO TECHNOLOGIES; Manufacturer PN: HDSM-541C; Supplier 1: Digikey; Supplier Part Number 1: 516-2248-1-ND
U5 = SN74LS47: Manufacturer: Texas Instruments; Manufacturer PN: SN74LS47NSR; Supplier 1: Digikey; Supplier Part Number 1: 296-13223-1-ND

## Nets that join several sheets
GND: Camera_Board (9 pins), Bluetooth (9 pins), Camera (8 pins), Camera_MCU (17 pins), Camera_LED_Display (U5.8)
V_3.3_Camera: Camera_Board (D3.1 D4.1 U4.5), Bluetooth (Bluetooth_Chip.11 C6.1 C7.1), Camera (U2.1 U2.8), Camera_MCU (14 pins), Camera_LED_Display (U5.3 U5.5)
V_5_Camera: Camera_Board (5 pins), Camera (Camera_5V_TP.1 Camera_connector.1 U2.14), Camera_LED_Display (10 pins)
PA0: Camera_MCU (MCU1.40 P4.5), Camera_LED_Display (U5.7)
PA1: Camera_MCU (MCU1.41 P4.4), Camera_LED_Display (U5.1)
PA2: Camera_MCU (MCU1.42 P4.3), Camera_LED_Display (U5.2)
PA3: Camera_MCU (MCU1.43 P4.2), Camera_LED_Display (U5.6)
PA6: Camera_MCU (MCU1.2 P5.2), Camera_LED_Display (U5.4)
PA7: Camera_MCU (MCU1.3 P5.3), Camera_LED_Display (R17.2 R18.2)
PC2: Bluetooth (Bluetooth_Chip.14 BT_TX_TP.1), Camera_MCU (MCU1.12 P6.1)
PC3: Bluetooth (Bluetooth_Chip.13 BT_RX.1), Camera_MCU (MCU1.13 P6.2)
PD0: Bluetooth (Bluetooth_Chip.15 BT_RTS_TP.1), Camera_MCU (MCU1.20 P6.9)
PD1: Bluetooth (Bluetooth_Chip.16 BT_CTS_TP.1), Camera_MCU (MCU1.21 P6.10)
PD2: Bluetooth (Bluetooth_Chip.5 BT_RESET_TP.1), Camera_MCU (MCU1.22 P6.11)
PD3: Camera (R5.1), Camera_MCU (MCU1.23 P7.11)
PD4: Camera (R4.1), Camera_MCU (MCU1.24 P7.10)
PD6: Camera (Camera_TXD_3V3_TP.1 U2.2), Camera_MCU (MCU1.26 P7.8)
PD7: Camera (Camera_RXD_3V3_TP.1 U2.3), Camera_MCU (MCU1.27 P7.7)
PE2: Camera_Board (H1.3), Camera_MCU (MCU1.32 P7.2)
PE3: Camera_Board (H1.5), Camera_MCU (MCU1.33 P7.1)